# EAGLE design ep2c5(cpm) (EAGLE 7.2.0)
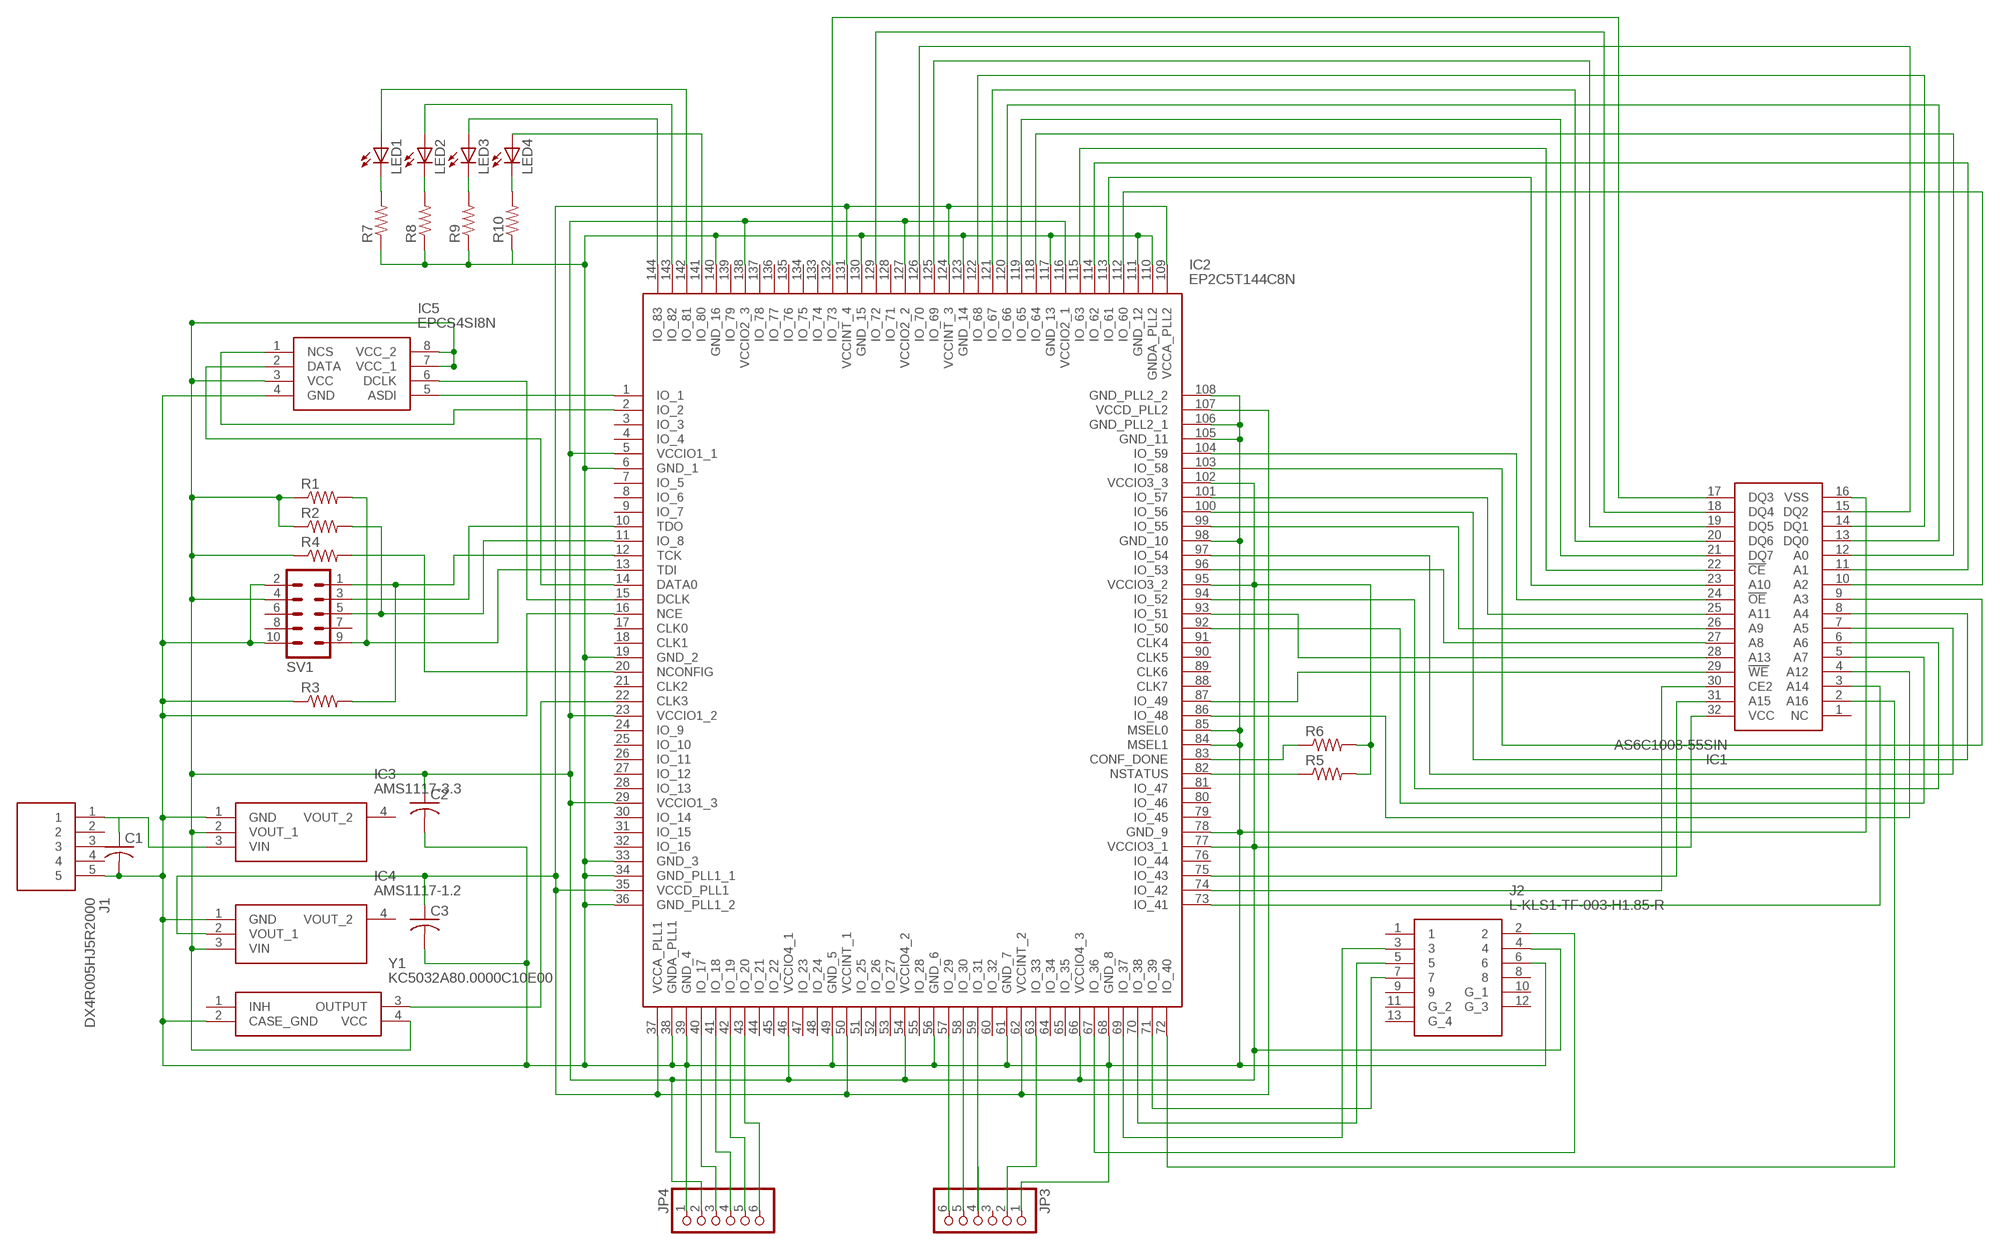
[diagram p0: schematic, sheet 1]

## Parts
C1  C-USC0805  [C0805]
C2  C-USC0805  [C0805]
C3  C-USC0805  [C0805]
IC1  AS6C1008-55SIN  [SOIC127P1407X299-32N]
IC2  EP2C5T144C8N  [QFP50P2200X2200X160-144N]
IC3  AMS1117-3.3  [SOT229P700X180-4N]
IC4  AMS1117-1.2  AMS1117-3.3  [SOT229P700X180-4N]
IC5  EPCS4SI8N  [SOIC127P600X175-8N]
J1  DX4R005HJ5R2000  [DX4R005HJ5]
J2  L-KLS1-TF-003-H1.85-R  [L-KLS1-TF-003-H1.85-R]
JP3  PINHD-1X6  [1X06]
JP4  PINHD-1X6  [1X06]
LED1  LEDCHIP-LED0805  [CHIP-LED0805]
LED2  LEDCHIP-LED0805  [CHIP-LED0805]
LED3  LEDCHIP-LED0805  [CHIP-LED0805]
LED4  LEDCHIP-LED0805  [CHIP-LED0805]
R1  R-US_R0805  [R0805]
R2  R-US_R0805  [R0805]
R3  R-US_R0805  [R0805]
R4  R-US_R0805  [R0805]
R5  R-US_R0805  [R0805]
R6  R-US_R0805  [R0805]
R7  R-US_R0805  [R0805]
R8  R-US_R0805  [R0805]
R9  R-US_R0805  [R0805]
R10  R-US_R0805  [R0805]
SV1  MA05-2  [MA05-2]
Y1  KC5032A80.0000C10E00  [KC5032A12.0000CM0E00]

## Nets
GND: C1.2 C2.2 C3.2 IC1.16(VSS) IC2.6(GND_1) IC2.16(NCE) IC2.19(GND_2) IC2.33(GND_3) IC2.34(GND_PLL1_1) IC2.36(GND_PLL1_2) IC2.38(GNDA_PLL1) IC2.39(GND_4) IC2.49(GND_5) IC2.56(GND_6) IC2.61(GND_7) IC2.68(GND_8) IC2.78(GND_9) IC2.84(MSEL1) IC2.85(MSEL0) IC2.98(GND_10) IC2.105(GND_11) IC2.106(GND_PLL2_1) IC2.108(GND_PLL2_2) IC2.110(GNDA_PLL2) IC2.111(GND_12) IC2.117(GND_13) IC2.123(GND_14) IC2.130(GND_15) IC2.140(GND_16) IC3.1(GND) IC4.1(GND) IC5.4(GND) J1.5 J2.6 JP3.1 JP4.1 R3.1 R7.1 R8.1 R9.1 R10.1 SV1.2 SV1.10 Y1.2(CASE_GND)
N$1: C3.1 IC2.35(VCCD_PLL1) IC2.37(VCCA_PLL1) IC2.50(VCCINT_1) IC2.62(VCCINT_2) IC2.107(VCCD_PLL2) IC2.109(VCCA_PLL2) IC2.124(VCCINT_3) IC2.131(VCCINT_4) IC4.2(VOUT_1)
N$2: IC2.1(IO_1) IC5.5(ASDI)
N$3: IC2.2(IO_2) IC5.1(NCS)
N$4: IC2.15(DCLK) IC5.6(DCLK)
N$5: IC2.14(DATA0) IC5.2(DATA)
N$6: IC2.12(TCK) R3.2 SV1.1
N$7: IC2.10(TDO) SV1.3
N$8: IC2.13(TDI) R1.2 SV1.9
N$9: IC2.11(IO_8) R2.2 SV1.5
N$10: IC1.31(A15) IC2.75(IO_43)
N$11: IC2.20(NCONFIG) R4.2
N$12: IC2.82(NSTATUS) R5.1
N$13: IC2.83(CONF_DONE) R6.1
N$14: IC2.22(CLK3) Y1.3(OUTPUT)
N$15: IC1.30(CE2) IC2.74(IO_42)
N$16: IC1.3(A14) IC2.73(IO_41)
N$17: IC1.2(A16) IC2.72(IO_40)
N$18: IC1.4(A12) IC2.86(IO_48)
N$19: IC1.29(!WE) IC2.87(IO_49)
N$20: IC1.5(A7) IC2.92(IO_50)
N$21: IC1.28(A13) IC2.93(IO_51)
N$22: IC1.6(A6) IC2.94(IO_52)
N$23: IC1.27(A8) IC2.96(IO_53)
N$24: IC1.7(A5) IC2.97(IO_54)
N$25: IC1.26(A9) IC2.99(IO_55)
N$26: IC1.8(A4) IC2.100(IO_56)
N$27: IC1.25(A11) IC2.101(IO_57)
N$28: IC1.9(A3) IC2.103(IO_58)
N$29: IC1.24(!OE) IC2.104(IO_59)
N$30: IC1.10(A2) IC2.112(IO_60)
N$31: IC1.23(A10) IC2.113(IO_61)
N$32: IC1.11(A1) IC2.114(IO_62)
N$33: IC1.22(!CE) IC2.115(IO_63)
N$34: IC1.12(A0) IC2.118(IO_64)
N$35: IC1.21(DQ7) IC2.119(IO_65)
N$36: IC1.13(DQ0) IC2.120(IO_66)
N$37: IC1.20(DQ6) IC2.121(IO_67)
N$38: IC1.14(DQ1) IC2.122(IO_68)
N$39: IC1.15(DQ2) IC2.126(IO_70)
N$40: IC1.19(DQ5) IC2.125(IO_69)
N$41: IC1.18(DQ4) IC2.129(IO_72)
N$42: IC1.17(DQ3) IC2.132(IO_73)
N$43: IC2.71(IO_39) J2.7
N$44: IC2.70(IO_38) J2.5
N$45: IC2.69(IO_37) J2.3
N$46: IC2.67(IO_36) J2.2
N$47: IC2.58(IO_30) JP3.5
N$48: IC2.57(IO_29) JP3.6
N$49: IC2.63(IO_33) JP3.2
N$50: IC2.59(IO_31) JP3.4
N$51: IC2.40(IO_17) JP4.3
N$52: IC2.41(IO_18) JP4.4
N$53: IC2.42(IO_19) JP4.5
N$54: IC2.43(IO_20) JP4.6
N$55: LED1.C R7.2
N$56: LED2.C R8.2
N$57: LED3.C R9.2
N$58: IC2.144(IO_83) LED3.A
N$59: IC2.143(IO_82) LED2.A
N$60: IC2.142(IO_81) LED1.A
N$65: LED4.C R10.2
N$66: IC2.141(IO_80) LED4.A
V3.3: C2.1 IC1.32(VCC) IC2.5(VCCIO1_1) IC2.23(VCCIO1_2) IC2.29(VCCIO1_3) IC2.46(VCCIO4_1) IC2.54(VCCIO4_2) IC2.66(VCCIO4_3) IC2.77(VCCIO3_1) IC2.95(VCCIO3_2) IC2.102(VCCIO3_3) IC2.116(VCCIO2_1) IC2.127(VCCIO2_2) IC2.138(VCCIO2_3) IC3.2(VOUT_1) IC4.3(VIN) IC5.3(VCC) IC5.7(VCC_1) IC5.8(VCC_2) J2.4 JP4.2 R1.1 R2.1 R4.1 R5.2 R6.2 SV1.4 Y1.4(VCC)
V5.0: C1.1 IC3.3(VIN) J1.1
Unconnected: IC1.1(NC) IC2.3(IO_3) IC2.4(IO_4) IC2.7(IO_5) IC2.8(IO_6) IC2.9(IO_7) IC2.17(CLK0) IC2.18(CLK1) IC2.21(CLK2) IC2.24(IO_9) IC2.25(IO_10) IC2.26(IO_11) IC2.27(IO_12) IC2.28(IO_13) IC2.30(IO_14) IC2.31(IO_15) IC2.32(IO_16) IC2.44(IO_21) IC2.45(IO_22) IC2.47(IO_23) IC2.48(IO_24) IC2.51(IO_25) IC2.52(IO_26) IC2.53(IO_27) IC2.55(IO_28) IC2.60(IO_32) IC2.64(IO_34) IC2.65(IO_35) IC2.76(IO_44) IC2.79(IO_45) IC2.80(IO_46) IC2.81(IO_47) IC2.88(CLK7) IC2.89(CLK6) IC2.90(CLK5) IC2.91(CLK4) IC2.128(IO_71) IC2.133(IO_74) IC2.134(IO_75) IC2.135(IO_76) IC2.136(IO_77) IC2.137(IO_78) IC2.139(IO_79) IC3.4(VOUT_2) IC4.4(VOUT_2) J1.2 J1.3 J1.4 J2.1 J2.8 J2.9 J2.10(G_1) J2.11(G_2) J2.12(G_3) J2.13(G_4) JP3.3 SV1.6 SV1.7 SV1.8 Y1.1(INH)

## Library data of the parts
C1-C3 = adafruit:C-US: CAPACITOR, American symbol
IC1 = AS6C1008-55SIN:AS6C1008-55SIN: Alliance Memory AS6C1008-55SIN SRAM Memory, 1Mbit, 2.7 5.5 V, 55ns 32-Pin SOP Source: Datasheet <https://componentsearchengine.com/Datasheets/2/AS6C1008-55SIN.pdf>; DESCRIPTION: Alliance Memory AS6C1008-55SIN SRAM Memory, 1Mbit, 2.7 5.5 V, 55ns 32-Pin SOP; HEIGHT: mm; MANUFACTURER_NAME: Alliance Memory; MANUFACTURER_PART_NUMBER: AS6C1008-55SIN; MOUSER_PART_NUMBER: 913-AS6C1008-55SIN; MOUSER_PRICE-STOCK: https://www.mouser.com/Search/Refine.aspx?Keyword=913-AS6C1008-55SIN; RS_PART_NUMBER: 0538170; RS_PRICE-STOCK: http://uk.rs-online.com/web/p/products/0538170
IC2 = EP2C5T144C8N:EP2C5T144C8N: Cyclone Devices Source: Datasheet <http://componentsearchengine.com/Datasheets/1/EP2C5T144C8N.pdf>; DESCRIPTION: Cyclone Devices; HEIGHT: 1.6mm; MANUFACTURER_NAME: Intel; MANUFACTURER_PART_NUMBER: EP2C5T144C8N; MOUSER_PART_NUMBER: 989-EP2C5T144C8N; MOUSER_PRICE-STOCK: https://www.mouser.com/Search/Refine.aspx?Keyword=989-EP2C5T144C8N; RS_PART_NUMBER: 6244206; RS_PRICE-STOCK: http://uk.rs-online.com/web/p/products/6244206
IC3 IC4 = AMS1117-3.3:AMS1117-3.3: 1A LOW DROPOUT VOLTAGE REGULATOR, SOT-223 Source: Datasheet <http://www.advanced-monolithic.com/pdf/ds1117.pdf>; DESCRIPTION: 1A LOW DROPOUT VOLTAGE REGULATOR, SOT-223; HEIGHT: 1.8mm; MANUFACTURER_NAME: Advanced Monolithic Systems; MANUFACTURER_PART_NUMBER: AMS1117-3.3
IC5 = EPCS4SI8N:EPCS4SI8N: EPCS4SI8N, Configuration Memory 20MHz 2.7 to 3.6V 8-Pin SOIC Source: Datasheet <http://www.altera.co.uk/literature/hb/cfg/cyc_c51014.pdf>; ALLIED_NUMBER: R1075815; ALLIED_PRICE-STOCK: http://www.alliedelec.com/altera-epcs4si8n/R1075815/; DESCRIPTION: EPCS4SI8N, Configuration Memory 20MHz 2.7 to 3.6V 8-Pin SOIC; HEIGHT: 1.75mm; MANUFACTURER_NAME: Intel; MANUFACTURER_PART_NUMBER: EPCS4SI8N; MOUSER_PART_NUMBER: 989-EPCS4SI8N; MOUSER_PRICE-STOCK: https://www.mouser.com/Search/Refine.aspx?Keyword=989-EPCS4SI8N; RS_PART_NUMBER: 5458707; RS_PRICE-STOCK: http://uk.rs-online.com/web/p/products/5458707
J1 = USB-Micro_2:DX4R005HJ5R2000: USB Connectors microUSB 2.0 TYPE B STDMNT RCPT NO TAPER Source: Datasheet <https://www.jae.com/z-en/pdf_download_exec.cfm?param=SJ111770.pdf>; ALLIED_NUMBER: 70627266; ALLIED_PRICE-STOCK: http://www.alliedelec.com/jae-electronics-inc-dx4r005hj5r2000/70627266/; ARROW_PART_NUMBER: DX4R005HJ5R2000; DESCRIPTION: USB Connectors microUSB 2.0 TYPE B STDMNT RCPT NO TAPER; HEIGHT: mm; MANUFACTURER_NAME: JAE Electronics; MANUFACTURER_PART_NUMBER: DX4R005HJ5R2000
J2 = L-KLS1-TF-003-H1.85-R:L-KLS1-TF-003-H1.85-R: Micro SD Card Connector Source: Datasheet <https://img.ozdisan.com/ETicaret_Dosya/476392_7149645.pdf>; DESCRIPTION: Micro SD Card Connector; HEIGHT: mm; MANUFACTURER_NAME: KLS Electronic; MANUFACTURER_PART_NUMBER: L-KLS1-TF-003-H1.85-R
JP3 JP4 = adafruit:PINHD-1X6: PIN HEADER
LED1-LED4 = adafruit:LED: LED OSRAM: - CHIPLED LG R971, LG N971, LY N971, LG Q971, LY Q971, LO R971, LY R971 LH N974, LH R974 LS Q976, LO Q976, LY Q976 LO Q996 - Hyper CHIPLED LW Q18S LB Q993, LB Q99A, LB R99A - SideLED LS A670, LO A670, LY A670, LG A670, LP A670 LB A673, LV A673, LT A673, LW A673 LH A674 LY A675 LS A676, LA A676, LO A676, LY A676, LW A676 LS A679, LY A679, LG A679 - Hyper Micro SIDELED® LS Y876, LA Y876, LO Y876, LY Y876 LT Y87S - SmartLED LW L88C, LW L88S LB L89C, LB L89S, LG L890 LS L89K, LO L89K, LY L89K LS L896, LA L896, LO L896, LY L896 - TOPLED LS T670, LO T670, LY T670, LG T670, LP T670 LSG T670, LSP T670, LSY T670, LOP T670, LYG T670 LG T671, LOG T671, LSG T671 LB T673, LV T673, LT T673, LW T673 LH T674 LS T676, LA T676, LO T676, LY T676, LB T676, LH T676, LSB T676, LW T676 LB T67C, LV T67C, LT T67C, LS T67K, LO T67K, LY T67K, LW E67C LS E67B, LA E67B, LO E67B, LY E67B, LB E67C, LV E67C, LT E67C LW T67C LS T679, LY T679, LG T679 LS T770, LO T770, LY T770, LG T770, LP T770 LB T773, LV T773, LT T773, LW T773 LH T774 LS E675, LA E675, LY E675, LS T675 LS T776, LA T776, LO T776, LY T776, LB T776 LHGB T686 LT T68C, LB T68C - Hyper Mini TOPLED® LB M676 - Mini TOPLED Santana® LG M470 LS M47K, LO M47K, LY M47K Source: http://www.osram.convergy.de/
R1-R10 = adafruit:R-US_: RESISTOR, American symbol
SV1 = con-lstb:MA05-2: PIN HEADER; OC_FARNELL: unknown; OC_NEWARK: unknown
Y1 = KC5032A80.0000C10E00:KC5032A80.0000C10E00: KC5032A80.0000C10E00, Crystal Oscillator, 80 MHz, 50ppm CMOS 15pF, 4-Pin CSMD, 5 x 3.2 x 1mm Source: Datasheet <http://uk.rs-online.com/web/p/products/1110767>; DESCRIPTION: KC5032A80.0000C10E00, Crystal Oscillator, 80 MHz, 50ppm CMOS 15pF, 4-Pin CSMD, 5 x 3.2 x 1mm; HEIGHT: mm; MANUFACTURER_NAME: KYOCERA; MANUFACTURER_PART_NUMBER: KC5032A80.0000C10E00; MOUSER_PART_NUMBER: 1110767P; MOUSER_PRICE-STOCK: http://uk.rs-online.com/web/p/products/1110767P; RS_PART_NUMBER: 1110767P; RS_PRICE-STOCK: http://uk.rs-online.com/web/p/products/1110767P

## Net classes
0 default: width 0.35 mm

## Board
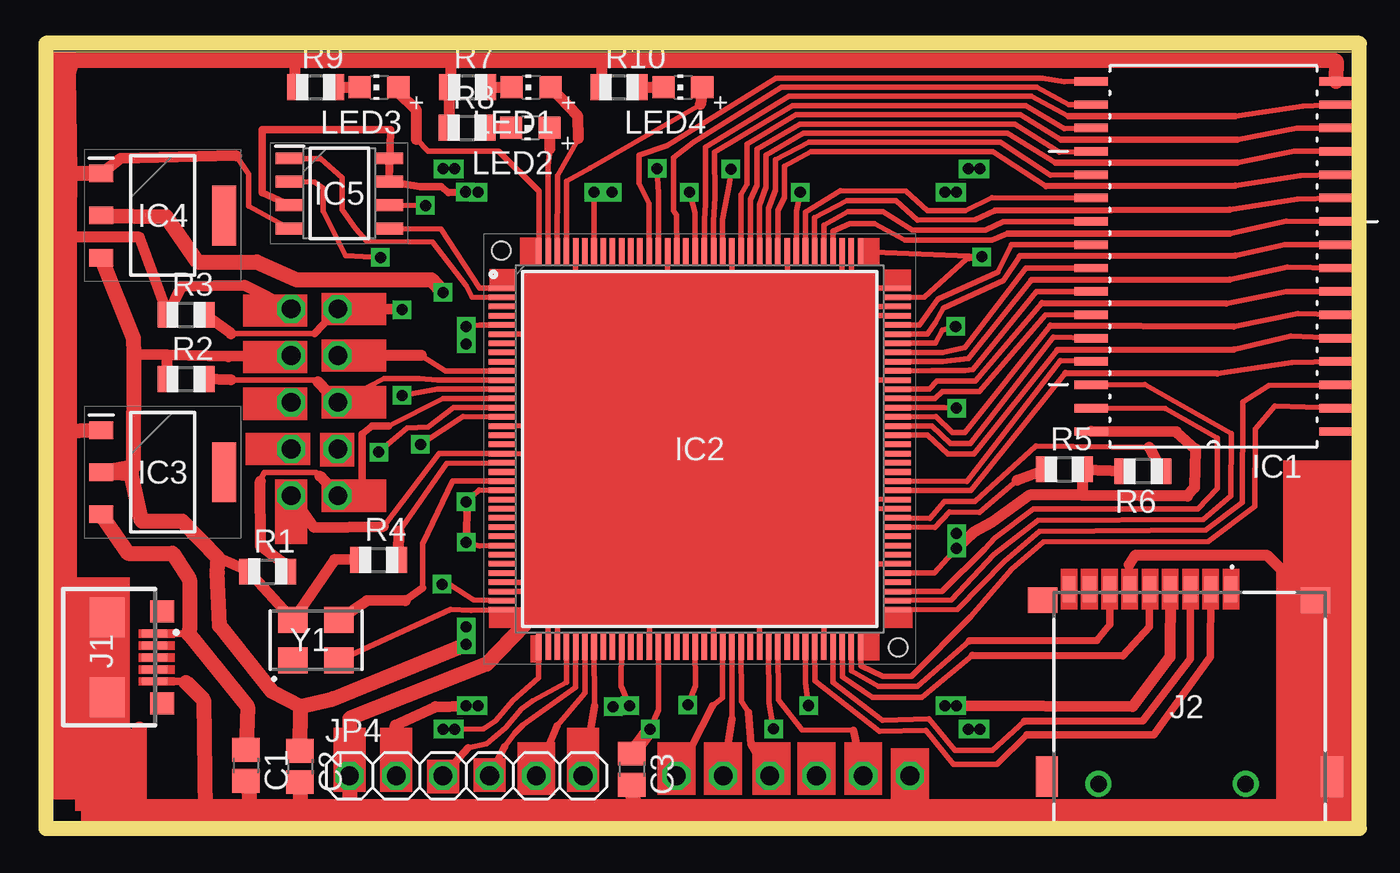
[diagram p1: board, top side]
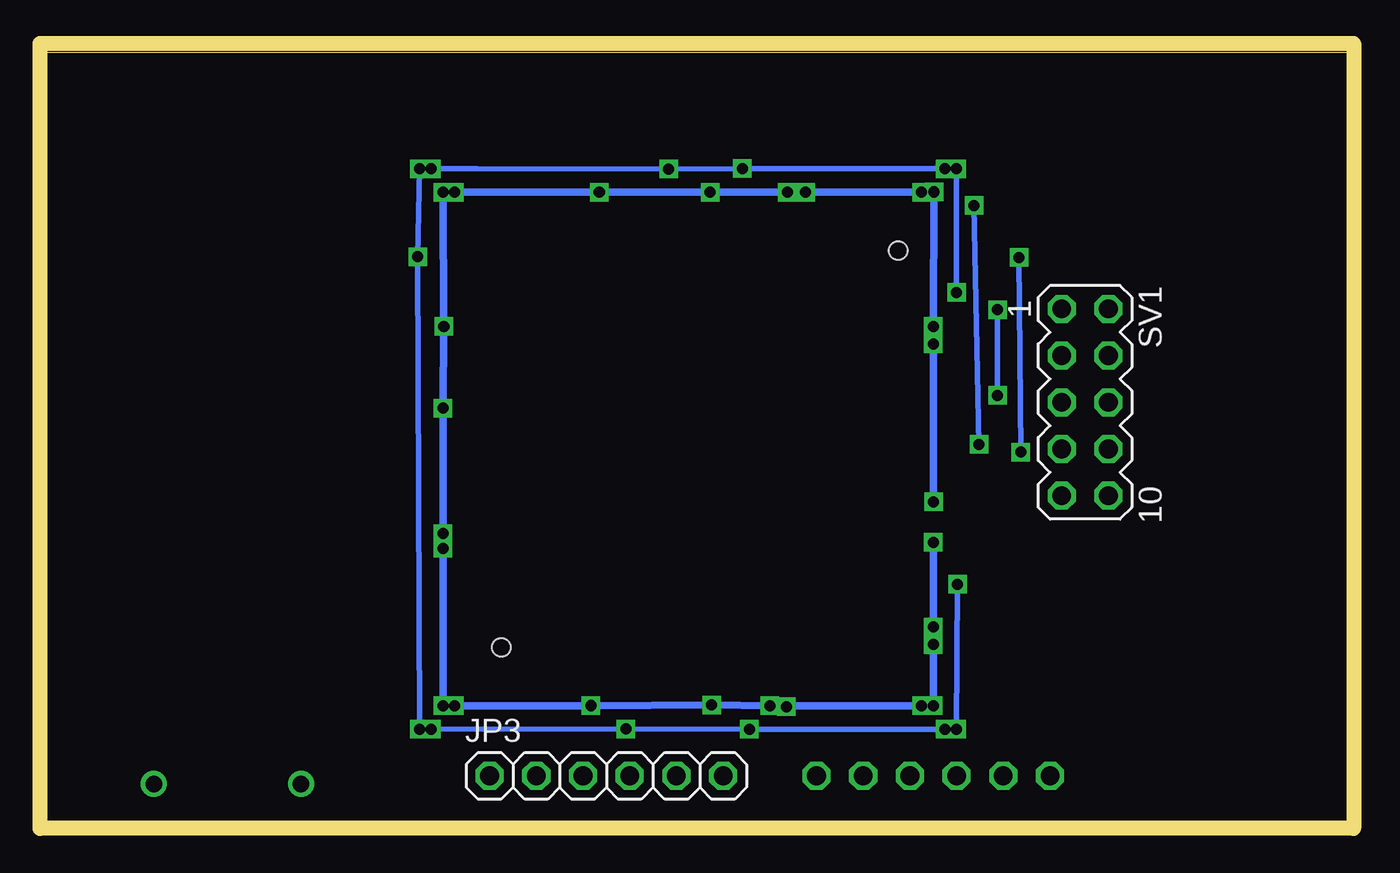
[diagram p2: board, bottom side, seen from below]

Size 71.12 x 41.91 mm. Coordinates in mm from the lower left corner, seen from the top.
Outline: 0,0 71.12,0 71.12,41.91 0,41.91 0,0
Copper layers (1*16): Top 0.035mm / dielectric 1.5mm / Bottom 0.035mm
Design rules "default": minimum track width 10mil, minimum drill 24mil, track to track 8mil, track to pad 8mil, pad to pad 8mil, via to via 8mil, smd to smd 8mil, copper to edge 40mil, drill to drill 8mil, minimum pad ring 10mil, minimum via ring 8mil, stop-mask expansion 4mil, vias tented up to drill 0mil, thermal gap 10mil
Holes 1 mm at 24.77,31.11 46.35,9.53
Milling: 4 lines

### Footprints (pad centres in the part's own frame; a part is rotated, then mirrored left to right if it is on the bottom)
C0805 = smd 1.3 x 1.5: 1 -0.85,0; 2 0.85,0
SOIC127P1407X299-32N = smd 1.803 x 0.457: 1 -6.655,9.525; 2 -6.655,8.255; 3 -6.655,6.985; 4 -6.655,5.715; 5 -6.655,4.445; 6 -6.655,3.175; 7 -6.655,1.905; 8 -6.655,0.635; 9 -6.655,-0.635; 10 -6.655,-1.905; 11 -6.655,-3.175; 12 -6.655,-4.445; 13 -6.655,-5.715; 14 -6.655,-6.985; 15 -6.655,-8.255; 16 -6.655,-9.525; 17 6.655,-9.525; 18 6.655,-8.255; 19 6.655,-6.985; 20 6.655,-5.715; 21 6.655,-4.445; 22 6.655,-3.175; 23 6.655,-1.905; 24 6.655,-0.635; 25 6.655,0.635; 26 6.655,1.905; 27 6.655,3.175; 28 6.655,4.445; 29 6.655,5.715; 30 6.655,6.985; 31 6.655,8.255; 32 6.655,9.525
QFP50P2200X2200X160-144N = smd 1.475 x 0.3: 1 -10.738,8.75; 2 -10.738,8.25; 3 -10.738,7.75; 4 -10.738,7.25; 5 -10.738,6.75; 6 -10.738,6.25; 7 -10.738,5.75; 8 -10.738,5.25; 9 -10.738,4.75; 10 -10.738,4.25; 11 -10.738,3.75; 12 -10.738,3.25; 13 -10.738,2.75; 14 -10.738,2.25; 15 -10.738,1.75; 16 -10.738,1.25; 17 -10.738,0.75; 18 -10.738,0.25; 19 -10.738,-0.25; 20 -10.738,-0.75; 21 -10.738,-1.25; 22 -10.738,-1.75; 23 -10.738,-2.25; 24 -10.738,-2.75; 25 -10.738,-3.25; 26 -10.738,-3.75; 27 -10.738,-4.25; 28 -10.738,-4.75; 29 -10.738,-5.25; 30 -10.738,-5.75; 31 -10.738,-6.25; 32 -10.738,-6.75; 33 -10.738,-7.25; 34 -10.738,-7.75; 35 -10.738,-8.25; 36 -10.738,-8.75; 73 10.738,-8.75; 74 10.738,-8.25; 75 10.738,-7.75; 76 10.738,-7.25; 77 10.738,-6.75; 78 10.738,-6.25; 79 10.738,-5.75; 80 10.738,-5.25; 81 10.738,-4.75; 82 10.738,-4.25; 83 10.738,-3.75; 84 10.738,-3.25; 85 10.738,-2.75; 86 10.738,-2.25; 87 10.738,-1.75; 88 10.738,-1.25; 89 10.738,-0.75; 90 10.738,-0.25; 91 10.738,0.25; 92 10.738,0.75; 93 10.738,1.25; 94 10.738,1.75; 95 10.738,2.25; 96 10.738,2.75; 97 10.738,3.25; 98 10.738,3.75; 99 10.738,4.25; 100 10.738,4.75; 101 10.738,5.25; 102 10.738,5.75; 103 10.738,6.25; 104 10.738,6.75; 105 10.738,7.25; 106 10.738,7.75; 107 10.738,8.25; 108 10.738,8.75 | smd 0.3 x 1.475: 37 -8.75,-10.738; 38 -8.25,-10.738; 39 -7.75,-10.738; 40 -7.25,-10.738; 41 -6.75,-10.738; 42 -6.25,-10.738; 43 -5.75,-10.738; 44 -5.25,-10.738; 45 -4.75,-10.738; 46 -4.25,-10.738; 47 -3.75,-10.738; 48 -3.25,-10.738; 49 -2.75,-10.738; 50 -2.25,-10.738; 51 -1.75,-10.738; 52 -1.25,-10.738; 53 -0.75,-10.738; 54 -0.25,-10.738; 55 0.25,-10.738; 56 0.75,-10.738; 57 1.25,-10.738; 58 1.75,-10.738; 59 2.25,-10.738; 60 2.75,-10.738; 61 3.25,-10.738; 62 3.75,-10.738; 63 4.25,-10.738; 64 4.75,-10.738; 65 5.25,-10.738; 66 5.75,-10.738; 67 6.25,-10.738; 68 6.75,-10.738; 69 7.25,-10.738; 70 7.75,-10.738; 71 8.25,-10.738; 72 8.75,-10.738; 109 8.75,10.738; 110 8.25,10.738; 111 7.75,10.738; 112 7.25,10.738; 113 6.75,10.738; 114 6.25,10.738; 115 5.75,10.738; 116 5.25,10.738; 117 4.75,10.738; 118 4.25,10.738; 119 3.75,10.738; 120 3.25,10.738; 121 2.75,10.738; 122 2.25,10.738; 123 1.75,10.738; 124 1.25,10.738; 125 0.75,10.738; 126 0.25,10.738; 127 -0.25,10.738; 128 -0.75,10.738; 129 -1.25,10.738; 130 -1.75,10.738; 131 -2.25,10.738; 132 -2.75,10.738; 133 -3.25,10.738; 134 -3.75,10.738; 135 -4.25,10.738; 136 -4.75,10.738; 137 -5.25,10.738; 138 -5.75,10.738; 139 -6.25,10.738; 140 -6.75,10.738; 141 -7.25,10.738; 142 -7.75,10.738; 143 -8.25,10.738; 144 -8.75,10.738
SOT229P700X180-4N = smd 1.3 x 0.95: 1 -3.35,2.29; 2 -3.35,0; 3 -3.35,-2.29 | smd 1.3 x 3.25: 4 3.35,0
SOIC127P600X175-8N = smd 1.525 x 0.65: 1 -2.712,1.905; 2 -2.712,0.635; 3 -2.712,-0.635; 4 -2.712,-1.905; 5 2.712,-1.905; 6 2.712,-0.635; 7 2.712,0.635; 8 2.712,1.905
DX4R005HJ5 = smd 0.4 x 1.35: 1 2.41,-0.429; 2 3.06,-0.429; 3 3.71,-0.429; 4 4.36,-0.429; 5 5.01,-0.429 | smd 1.2 x 1.3: 6 6.21,-0.029; 7 1.21,-0.029 | smd 2.15 x 1.9: 8 1.535,-3.029; 9 5.885,-3.029
L-KLS1-TF-003-H1.85-R = smd 0.7 x 1.4: 1 2.25,10.6; 2 1.15,10.6; 3 0.05,10.6; 4 -1.05,10.6; 5 -2.15,10.6; 6 -3.25,10.6; 7 -4.35,10.6; 8 -5.45,10.6; 9 -6.55,10.6 | smd 1.6 x 1.4: 10 -8,10; 13 6.85,10 | smd 1.2 x 2.2: 11 -7.75,0.4; 12 7.75,0.4 | drill 0.9 pad 1.4: 14 3.05,0; 15 -4.95,0
1X06 = drill 1.016 octagon: 1 -6.35,0; 2 -3.81,0; 3 -1.27,0; 4 1.27,0; 5 3.81,0; 6 6.35,0
CHIP-LED0805 = smd 1.2 x 1.2: A 0,-1.05; C 0,1.05
R0805 = smd 1.1 x 1.4: 1 -1,0; 2 1,0
MA05-2 = drill 1.016 octagon: 1 -5.08,-1.27; 2 -5.08,1.27; 3 -2.54,-1.27; 4 -2.54,1.27; 5 0,-1.27; 6 0,1.27; 7 2.54,-1.27; 8 2.54,1.27; 9 5.08,-1.27; 10 5.08,1.27
KC5032A12.0000CM0E00 = smd 1.6 x 1.4: 1 -1.25,-1.1; 2 1.25,-1.1; 3 1.25,1.1; 4 -1.25,1.1

### Placement (x,y rotation side)
C1  10.88,3.11 270 top
C2  13.82,3.05 270 top
C3  31.87,2.9 270 top
IC1  63.5,30.8 180 top
IC2  35.56,20.32 0 top
IC3  6.35,19.05 0 top
IC4  6.35,33.02 0 top
IC5  15.96,34.22 0 top
J1  6.35,12.7 270 top
J2  62.2,2.1 0 top
JP3  40.64,2.54 0 bottom
JP4  22.86,2.54 0 top
LED1  26.39,39.99 90 top
LED2  26.34,37.79 90 top
LED3  18.12,39.99 90 top
LED4  34.65,40 90 top
R1  12.06,13.65 0 top
R2  7.62,24.13 0 top
R3  7.62,27.62 0 top
R4  18.1,14.29 0 top
R5  55.4,19.21 0 top
R6  59.67,19.11 180 top
R7  22.94,40 0 top
R8  22.9,37.8 0 top
R9  14.67,40 0 top
R10  31.18,40 0 top
SV1  14.61,22.86 270 bottom
Y1  14.69,9.92 0 top

### Tracks (layer width: path | path; a pad name or v marks a point on that pad's centre or on a via)
GND
  Top 0.305: 26.04,11.56 IC2.36 23.13,11.55 22.02,11.59 Y1.2 | 26.04,11.56 26.04,10.79 26.05,10.79 27.32,10.79 | 27.32,10.79 27.81,10.79 | 27.81,10.79 32.82,10.79 | 32.82,10.79 36.31,10.79 | 36.31,10.79 38.81,10.79 | 38.81,10.79 42.3,10.79 | 42.3,10.79 45.09,10.79 45.1,14.07 | 45.1,14.07 45.09,17.07 | 45.09,17.07 45.06,17.59 | 45.06,17.59 45.08,24.07 | 45.08,24.07 45.09,27.58 | 45.09,27.58 45.1,28.07 | 45.1,28.07 45.07,29.07 | 45.07,29.07 45.09,29.84 43.81,29.84 | 43.81,29.84 43.31,29.86 | 43.31,29.86 40.32,29.82 | 40.32,29.82 37.31,29.81 | 37.31,29.81 33.82,29.86 | 33.82,29.86 28.8,29.84 | 28.8,29.84 26.04,29.84 26.02,26.57 | 26.02,26.57 26.07,21.59 | 26.07,21.59 26.11,20.04 | 26.11,20.04 26.04,13.05 | 26.04,13.05 26.04,12.57 | 26.04,12.57 26.04,11.56 | IC2.34 26.04,12.57 | IC2.33 26.04,13.05 | IC2.38 27.32,10.79 | IC2.39 27.81,10.79 | IC2.49 32.82,10.79 | IC2.56 36.31,10.79 | IC2.61 38.81,10.79 | IC2.68 42.3,10.79 | IC2.78 45.1,14.07 | IC2.84 45.09,17.07 | IC2.98 45.08,24.07 | IC2.105 45.09,27.58 | IC2.106 45.1,28.07 | IC2.108 45.07,29.07 | IC2.110 43.81,29.84 | IC2.111 43.31,29.86 | IC2.117 40.32,29.82 | IC2.123 37.31,29.81 | IC2.130 33.82,29.86 | IC2.140 28.8,29.84 | IC2.6 26.02,26.57 | IC2.16 26.07,21.59 | 26.11,20.04 IC2.19 21.39,20.08 18.36,16.11 | 4.45,4.76 5.08,5.08 | 1.33,31.85 1.27,29.53 | J2.6 58.92,14.04 | IC2.85 45.06,17.59 | IC5.4 11.02,33.53 11.03,35.26 10.36,36.27
  Top 0.406: J1.5 7.62,7.69 7.62,7.62
  Top 0.61: 1.33,31.85 5.08,31.84 R3.1 7.34,29.15 10.79,29.21 SV1.2 | 58.92,14.04 59.26,14.55 66.4,14.55 67.31,13.65 | 10.36,36.27 4.04,36.12 IC4.1 | R8.1 21.94,37.48 R7.1 22.05,40 22.05,41.43 | R9.1 13.54,40 13.54,41.43 | R10.1 30.24,40 30.24,41.43 | SV1.10 14.56,16.06 18.36,16.11
  Top 0.813: 1.27,21.27 1.27,29.53 1.27,32.7 1.28,35.31 | 1.27,21.27 1.27,6.03 1.91,4.76 4.45,4.76 | IC3.1 1.27,21.27 | IC4.1 1.28,35.31 | 5.08,5.08 5.08,0.64 8.65,0.59 | 46.99,0.64 67.31,0.64 67.31,13.65 | 46.99,0.64 31.97,0.64 | 31.97,0.64 16.51,0.64 | 16.51,0.64 13.82,0.64 | 13.82,0.64 11.05,0.64 | 11.05,0.64 8.65,0.59 | 1.28,35.31 1.22,40.74 1.43,41.43 13.54,41.43 22.05,41.43 30.24,41.43 70.17,41.43 IC1.16 | JP3.1 46.99,0.64 | 16.51,0.64 JP4.1 16.53,5.66 23.98,8.62 26.05,10.79 | C1.2 11.04,1.67 11.05,0.64 | 7.62,7.62 8.57,6.67 8.65,0.59 | C2.2 13.82,0.64 | C3.2 31.97,0.64
N$1  (via drill 0.6)
  Top 0.305: v21.55,12.96 22.02,12.91 23.27,12.1 IC2.35 | IC2.107 47.77,28.59 50.07,30.64 v50.9,30.77 IC2.109 | IC2.37 26.8,7.86 25.42,6.66 24.44,5.52 23.8,5.1 v22.23,5.08 | IC2.62 39.32,6.51 v39.58,5.09 | IC2.50 33.31,6.13 v32.86,5.08 | IC2.124 36.81,32.81 37.18,34.77 v37.25,35.55 | IC2.131 33.32,34.24 33.3,34.66 v33.25,35.58
  Top 0.813: v21.59,28.83 20.97,29.53 13.64,29.53 11.48,30.5 8.26,30.5 6.53,32.97 IC4.2 | C3.1 v32.86,5.08
  Bottom 0.305: v21.59,28.83 v21.59,35.56 v22.23,35.56 v33.25,35.58 v37.25,35.55 47.67,35.56 v50.16,35.56 v50.8,35.56 v50.9,30.77 v50.8,5.08 v50.16,5.08 v39.58,5.09 v32.86,5.08 v22.23,5.08 v21.59,5.08 v21.55,12.96
N$2
  Top 0.305: IC5.5 21.49,32.29 23.57,29.07 IC2.1
N$3
  Top 0.305: IC2.2 23.18,28.57 22.86,29.21 21.04,31.58 17.47,31.59 16.83,32.3 16.1,33.34 16.1,35.08 14.93,36.11 IC5.1
N$4  (via drill 0.6)
  Top 0.305: v20.64,33.57 IC5.6 | IC2.15 22.68,22.07 v20.36,20.57
  Bottom 0.305: v20.36,20.57 v20.64,33.57
N$5  (via drill 0.6)
  Top 0.305: IC5.2 14.61,34.84 15.07,34.52 15.07,33.25 16.29,30.83 v18.2,30.74 | IC2.14 22.18,22.57 20.8,21.51 19.64,21.46 v18.1,20.16
  Bottom 0.305: v18.2,30.74 v18.1,20.16
N$6  (via drill 0.6)
  Top 0.305: 14.61,26.59 10.07,26.59 | IC2.12 21.3,23.57 v19.37,23.24
  Top 0.406: 14.61,26.59 SV1.1
  Top 0.61: v19.37,27.9 SV1.1 | 10.07,26.59 R3.2
  Bottom 0.305: v19.37,23.24 v19.37,27.9
N$7
  Top 0.305: IC2.10 21.73,24.57 20.41,25.41
  Top 0.61: 20.41,25.41 SV1.3
N$8
  Top 0.18: 14.71,19.03 14.9,18.84
  Top 0.305: 14.71,19.03 11.88,19.03 11.66,18.57 | IC2.13 21.61,23.07 18.63,21.57
  Top 0.406: 18.63,21.57 17.74,21.57 17.2,21.14 17.18,17.73
  Top 0.61: 17.18,17.73 SV1.9 14.9,18.84 | R1.2 13.12,13.97 11.68,15.04 11.66,18.57
N$9
  Top 0.305: IC2.11 21.3,24.07 20.3,24.15 18.39,24.15 SV1.5 | 10.07,24.08 14.59,24.07 14.78,23.98
  Top 0.61: 10.07,24.08 R2.2 | 14.78,23.98 SV1.5
N$10
  Top 0.305: IC1.31 60.87,22.52 63.72,20.93 63.72,18.18 62.65,17.05 53.72,17.05 51.62,15.47 51.07,14.9 48.72,12.58 IC2.75
N$11
  Top 0.305: IC2.20 21.79,19.55 19.2,15.84
  Top 0.61: 19.2,15.84 R4.2
N$12
  Top 0.305: IC2.82 48.34,16.05 49.15,16.89 50.77,16.88 52.82,18.61
  Top 0.61: R5.1 52.82,18.61
N$13
  Top 0.305: 60,20.41 53.84,20.48 50.53,17.46 48.87,17.46 48.07,16.55 IC2.83
  Top 0.61: 60,20.41 R6.1
N$14
  Top 0.305: IC2.22 22.13,18.59 20.48,15.16 20.48,12.77
  Top 0.406: 20.48,12.77 19.54,12.08
  Top 0.61: Y1.3 17.46,12.06 19.54,12.08
N$15
  Top 0.305: IC1.30 59.76,23.84 64.47,21.18 64.45,17.77 62.94,16.48 53.94,16.42 51.57,14.6 49.25,12.1 IC2.74
N$16
  Top 0.305: IC1.3 66.52,23.77 65.09,22.86 65.08,17.41 63.08,15.9 54.02,15.83 52.16,14.23 49.58,11.58 IC2.73
N$17
  Top 0.305: IC1.2 66.83,22.66 65.77,21.39 65.76,17.2 63.23,15.29 54.26,15.27 52.55,13.79 50.31,11.21 47.07,7.95 45.52,7.95 44.32,8.53 IC2.72
N$18
  Top 0.305: IC1.4 67.77,25.02 63.7,24.43 | 55.44,24.45 50.32,18.06 IC2.86
  Top 0.36: 63.7,24.43 55.44,24.45
N$19
  Top 0.305: IC1.29 55.18,25.12 50.09,18.56 IC2.87
N$20
  Top 0.305: 55.01,25.71 50.48,20.06 49.07,20.04 47.93,21.08 IC2.92 | 64.6,25.73 67.7,26.46 IC1.5
  Top 0.36: 64.6,25.73 55.01,25.71
N$21
  Top 0.305: IC2.93 48.2,21.57 49.19,20.62 50.29,20.62 54.79,26.41 IC1.28
N$22
  Top 0.305: IC1.6 68.09,27.7 64.6,26.98 | 54.62,27.03 49.98,21.21 49.31,21.23 48.4,22.08 IC2.94
  Top 0.36: 64.6,26.98 54.62,27.03
N$23
  Top 0.305: IC1.27 54.37,27.61 50.77,23.44 48.77,23.44 48.36,23.06 IC2.96
N$24
  Top 0.305: IC1.7 67.47,28.88 64.2,28.23 | 54.17,28.26 50.56,24.01 48.47,24.02 48.04,23.57 IC2.97
  Top 0.36: 64.2,28.23 54.17,28.26
N$25
  Top 0.305: IC1.26 53.88,28.89 50.43,24.66 49.97,24.57 48.19,24.58 IC2.99
N$26
  Top 0.305: IC1.8 67.53,30.23 64.4,29.54 | 53.59,29.52 50.17,25.25 48.75,25.08 47.87,25.07 IC2.100
  Top 0.36: 64.4,29.54 53.59,29.52
N$27
  Top 0.305: IC2.101 47.89,25.57 48.75,25.57 49.97,25.84 53.3,30.17 IC1.25
N$28
  Top 0.305: IC1.9 67.39,31.43 64.7,30.84 | 52.97,30.82 52.06,29.48 48.82,27.99 48.37,27.19 47.93,26.56 IC2.103
  Top 0.36: 64.7,30.84 52.97,30.82
N$29
  Top 0.305: IC2.104 47.52,27.07 48.52,28.46 51.41,29.79 51.78,29.95 52.51,31.43 IC1.24
N$30
  Top 0.305: 52.3,32.04 51.44,31.69 46.72,31.69 45.07,32.59 43.72,32.59 42.81,32.18 IC2.112 | 64.4,32.03 67.47,32.73 IC1.10
  Top 0.36: 64.4,32.03 52.3,32.04
N$31
  Top 0.305: IC1.23 52.07,32.69 51.11,32.24 47.12,32.24 45.52,33.24 43.62,33.24 42.31,32.51 IC2.113
N$32
  Top 0.305: 51.6,33.3 50.55,32.79 47.41,32.77 46.22,33.84 43.57,33.84 41.81,32.9 IC2.114 | 64.4,33.34 68.05,33.91 IC1.11
  Top 0.36: 64.4,33.34 51.6,33.3
N$33
  Top 0.305: IC1.22 51.46,33.99 50,33.29 47.93,33.28 46.77,34.34 43.21,34.37 41.31,33.2 IC2.115
N$34
  Top 0.305: 54.38,34.62 51.5,36.5 41.6,36.5 40.16,35.7 40.16,34.03 39.81,33.29 IC2.118 | 64.7,34.63 68.22,35.19 IC1.12
  Top 0.36: 64.7,34.63 54.38,34.62
N$35
  Top 0.305: IC1.21 54.62,35.23 51.9,37 41.5,37 39.67,36.05 39.67,34.4 39.31,33.4 IC2.119
N$36
  Top 0.305: 54.9,35.88 52.3,37.5 41.2,37.5 39.16,36.31 39.15,34.56 38.82,33.6 IC2.120 | IC1.13 67.89,36.53 64.8,35.88
  Top 0.36: 64.8,35.88 54.9,35.88
N$37
  Top 0.305: IC1.20 55.12,36.48 52.7,38 41,38 38.66,36.64 38.66,34.67 38.32,33.89 IC2.121
N$38
  Top 0.305: IC1.14 68.02,37.77 64.8,37.13 | 55.2,37.13 53,38.5 40.8,38.5 38.12,36.91 38.13,34.73 37.81,34.16 IC2.122
  Top 0.36: 64.8,37.13 55.2,37.13
N$39
  Top 0.305: IC1.15 68.37,38.97 64.7,38.44 | 55.6,38.44 53.6,39.5 40.4,39.5 35.87,36.75 35.87,33.65 35.81,32.8 IC2.126
  Top 0.36: 64.7,38.44 55.6,38.44
N$40
  Top 0.305: IC1.19 55.38,37.73 53.3,39 40.6,39 36.36,36.47 36.4,34.01 36.31,32.69 IC2.125
N$41
  Top 0.305: IC1.18 55.63,39.05 53.9,40 40,40 35.22,37.02 34.14,36.16 34.13,33.3 34.3,33.04 IC2.129
N$42
  Top 0.305: IC1.17 55.4,40.31 54.2,40.5 39.7,40.5 33.78,36.82 32.26,36.3 32.26,34.78 32.81,33.67 IC2.132
N$43
  Top 0.305: 50.22,9.88 47.39,7.4 45.28,7.4 43.82,8.25 IC2.71
  Top 0.406: J2.7 57.85,10.77 57.15,9.9 50.22,9.88
N$44
  Top 0.305: IC2.70 43.31,7.91 44.94,6.81 47.65,6.81 50.4,9.09
  Top 0.406: J2.5 60.01,10.64 58.58,9.07 50.4,9.09
N$45
  Top 0.305: 53.22,5.51 51.49,3.92 49.44,3.92 48.03,5.63 45.5,5.57 42.8,7.62 IC2.69
  Top 0.406: J2.3 62.23,8.89 59.66,5.52 53.22,5.51
N$46
  Top 0.305: 53.36,4.76 51.72,3.16 49.36,3.16 47.87,5.02 45.34,4.96 41.82,7.7 IC2.67
  Top 0.406: 53.36,4.76 60.25,4.78 63.34,9 J2.2
N$47
  Top 0.305: IC2.58 37.3,5.64
  Top 0.406: 37.3,5.64 JP3.5
N$48
  Top 0.305: IC2.57 36.8,6.78 36.26,6.34
  Top 0.406: 36.26,6.34 35.1,4.12 JP3.6
N$49
  Top 0.305: IC2.63 39.83,6.68 41.11,5.04 43.92,5.02
  Top 0.406: 43.92,5.02 JP3.2
N$50
  Top 0.305: IC2.59 37.84,6.58 38.2,6
  Top 0.406: 38.2,6 38.34,4.26 JP3.4
N$51
  Top 0.305: IC2.40 28.31,7.62 26.46,6.62 25.88,6.19 25,5.16 23.97,4.29 22.95,4.06
  Top 0.406: JP4.3 22.95,4.06
N$52
  Top 0.305: IC2.41 28.82,7.36 25.96,5.32 25.48,4.84 24.95,4.11
  Top 0.406: JP4.4 24.95,4.11
N$53
  Top 0.305: 27.8,5.26 29.32,7.05 IC2.42
  Top 0.406: JP4.5 27.8,5.26
N$54
  Top 0.305: 29.84,6.35 IC2.43
  Top 0.406: JP4.6 29.84,6.35
N$55
  Top 0.61: R7.2 LED1.C
N$56
  Top 0.61: R8.2 LED2.C
N$57
  Top 0.61: R9.2 LED3.C
N$58
  Top 0.305: IC2.144 26.82,34.35 24.61,36.53 20.79,36.53 20.16,37.16 | 19.16,39.73 LED3.A
  Top 0.61: 20.16,37.16 20.16,38.74 19.16,39.73
N$59
  Top 0.305: IC2.143 27.31,35.73 27.41,36.63
  Top 0.61: 27.41,36.63 LED2.A
N$60
  Top 0.305: IC2.142 27.82,35.18 28.96,37.21
  Top 0.61: 28.96,37.21 28.94,38.42 LED1.A
N$61  (via drill 0.6)
  other vias: 30.85,6.3
N$62
  Top 0.305: 47,2.5 46.95,2.5
N$63  (via drill 0.6)
  other vias: 22.86,26.04
N$64  (via drill 0.6)
  other vias: 49.53,15.72
N$65
  Top 0.61: R10.2 | R10.2 LED4.C
N$66
  Top 0.305: 35.59,39.05 29.61,35.59 28.31,34.89 IC2.141
  Top 0.61: LED4.A 35.59,39.05
V3.3  (via drill 0.6)
  Top 0.305: IC2.138 v29.81,34.29 | IC2.77 48.32,13.57 v49.53,14.92 | IC2.102 48.38,26.07 48.77,26.79 v49.48,26.98 | IC2.54 35.32,7.44 v34.91,6.4 | IC2.23 23.56,18.09 v22.85,17.45 | IC2.29 23.58,15.05 v22.86,15.24 | IC2.66 41.31,7.61 v41.48,6.36 | IC2.46 31.27,7.42 v31.75,6.35 | IC2.116 40.81,33.27 v41.02,34.29 | IC2.127 35.31,33.17 v35,34.29 | IC2.5 23.58,27.06 v22.86,26.99 | IC2.95 48.85,22.57 v49.53,22.54
  Top 0.406: IC5.3 11.75,34.27 11.75,37.7 18.74,37.7 IC5.7 | IC5.7 IC5.8 | v22.86,15.24 22.92,17.52 v22.85,17.45 | v22.82,34.31 21.9,34.26 21.5,34.58 20.36,34.58 IC5.7
  Top 0.61: 9.37,14.39 R1.1 Y1.4 15.7,14.3 R4.1 | R2.1 6.58,25.44 | 6.58,25.44 4.8,25.46 | R6.2 R5.2 56.37,17.82 | v49.53,14.92 50.44,15.78 51.44,16.33 53.51,17.81 56.37,17.82 | J2.4 61.13,9.01 59.09,6.3 v49.53,6.35 | IC1.32 61.49,21.25 62.52,20.32 62.47,18.23 62.09,17.75 59.56,17.75 56.37,17.8 56.37,17.82 | JP4.2 18.99,5.29 21.18,6.3 v22.86,6.35 | SV1.4 9.92,25.34 6.58,25.44
  Top 0.813: IC4.3 4.76,26.33 4.8,25.46 4.76,19.37 IC3.2 4.64,18.97 5.21,16.39 7.43,16.39 9.37,14.39 9.32,13.6 9.44,10.69 12.26,7.14 13.85,6.32 | 13.85,6.32 15.61,6.73 v22.86,9.68 | C2.1 13.85,6.32
  Bottom 0.406: v22.85,17.45 v22.86,26.99 v22.82,34.31 22.86,34.29 v23.5,34.29 v29.81,34.29 v30.8,34.29 v35,34.29 v41.02,34.29 v48.9,34.29 v49.53,34.29 v49.48,26.98 v49.53,22.54 v49.53,14.92 v49.53,6.35 v48.9,6.35 v41.48,6.36 v34.91,6.4 v31.75,6.35 v23.5,6.35 v22.86,6.35 v22.86,9.68 v22.86,10.64 v22.86,15.24
V5.0
  Top 0.406: J1.1 7.76,10.26 7.81,10.48
  Top 0.813: IC3.3 4.46,14.65 6.88,14.65 7.81,13.2 7.81,10.48 | 7.76,10.26 10.97,6.3 C1.1
(copper drawn outside any net)
  shapes: Top area x50